# Altium schematic sheet [0]-Main_Page.SchDoc
size A4
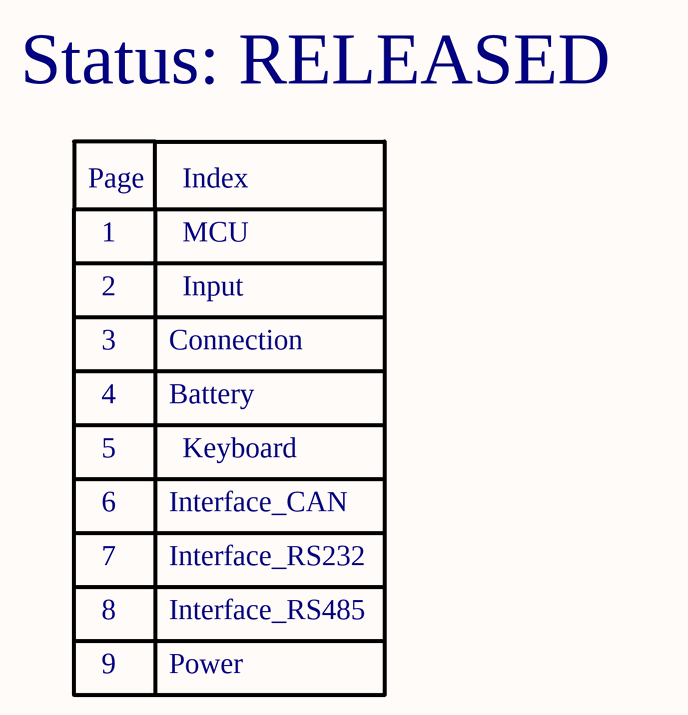
[diagram p0: [0]-Main_Page.SchDoc]

## Notes on the sheet
- Status: RELEASED
- Page
- Index
- 1
- MCU
- 2
- Input
- 3
- 4
- Connection
- Battery
- 5
- Keyboard
- 6
- Interface_CAN
- 7
- Interface_RS232
- 8
- 9
- Interface_RS485
- Power